# Altium project pcb.PrjPcb
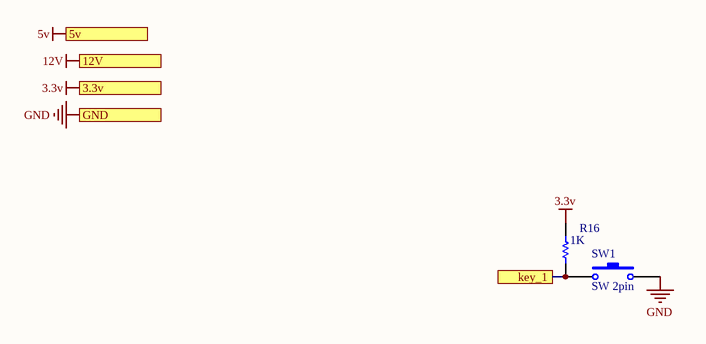
[diagram p0: key.SchDoc]
5 sheets, 153 parts. Net scope: flat (ports and power ports of the same name join across sheets).
Board file: pcb.PcbDoc
Sheets:
  key.SchDoc
  main.SchDoc
  Memory.SchDoc
  power.SchDoc
  comicition.SchDoc

## Sheet key.SchDoc
size A4

### Parts
R16  value 1K  [RES 0805 optional]  (hidden comment: resistor)
SW1  SW 2pin  [SW 2PIN]

### Ports
3.3v, 5v, 12V, GND, key_1

### Nets
3.3v: R16.2 ; port 3.3v
GND: SW1.2 ; port GND
NetR16_1: R16.1 SW1.1 ; port key_1

## Sheet main.SchDoc
size A4
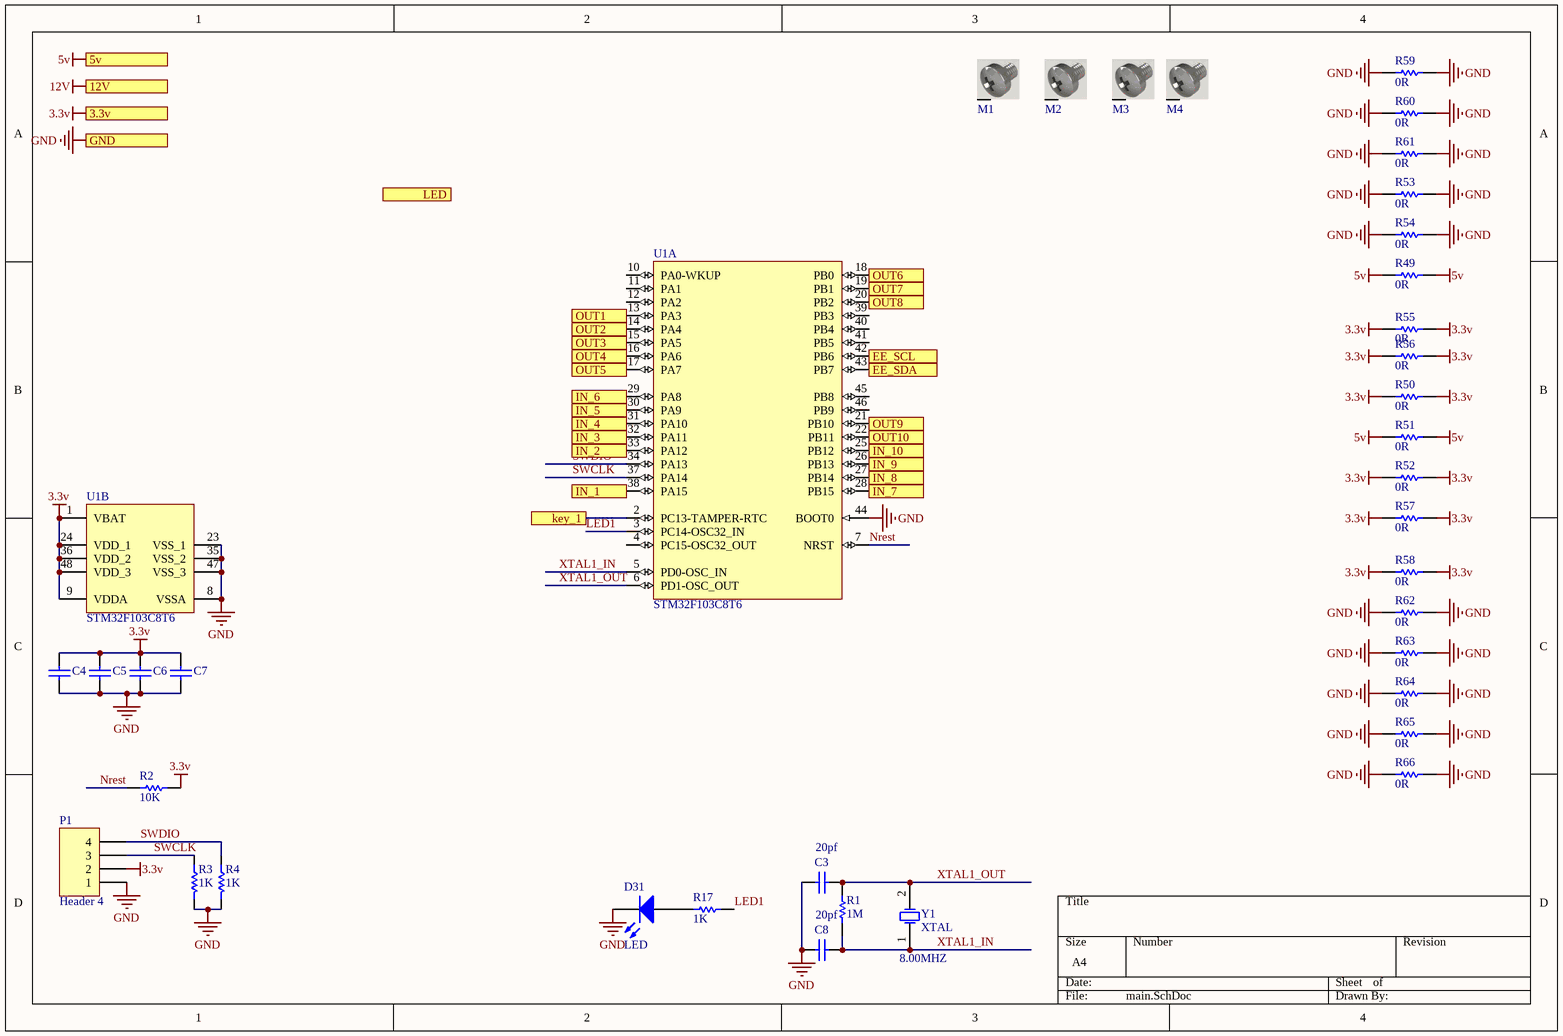
[diagram p1: main.SchDoc]

### Parts
C3  value 20pf  [RES 0805 (2012X06L)]
C4  (no value)  [RES 0805 (2012X06L)]
C5  (no value)  [RES 0805 (2012X06L)]
C6  (no value)  [RES 0805 (2012X06L)]
C7  (no value)  [RES 0805 (2012X06L)]
C8  value 20pf  [RES 0805 (2012X06L)]
D31  LED  [led 5mm]
M1  Screw  [Board Screw]  (value not drawn)
M2  Screw  [Board Screw]  (value not drawn)
M3  Screw  [Board Screw]  (value not drawn)
M4  Screw  [Board Screw]  (value not drawn)
P1  Header 4  [HDR1X4]
R1  value 1M  [RES 0805 (2012X06L)]  (hidden comment: Res1)
R2  valv: 10K  [RES 0805 (2012X06L)]
R3  1K  [RES 0805 (2012X06L)]
R4  1K  [RES 0805 (2012X06L)]
R17  value 1K  [RES 0805 (2012X06L)]  (hidden comment: resistor)
R49  value 0R  [RES 0805 optional]  (hidden comment: resistor)
R50  value 0R  [RES 0805 optional]  (hidden comment: resistor)
R51  value 0R  [RES 0805 optional]  (hidden comment: resistor)
R52  value 0R  [RES 0805 optional]  (hidden comment: resistor)
R53  value 0R  [RES 0805 optional]  (hidden comment: resistor)
R54  value 0R  [RES 0805 optional]  (hidden comment: resistor)
R55  value 0R  [RES 0805 optional]  (hidden comment: resistor)
R56  value 0R  [RES 0805 optional]  (hidden comment: resistor)
R57  value 0R  [RES 0805 optional]  (hidden comment: resistor)
R58  value 0R  [RES 0805 optional]  (hidden comment: resistor)
R59  value 0R  [RES 0805 optional]  (hidden comment: resistor)
R60  value 0R  [RES 0805 optional]  (hidden comment: resistor)
R61  value 0R  [RES 0805 optional]  (hidden comment: resistor)
R62  value 0R  [RES 0805 optional]  (hidden comment: resistor)
R63  value 0R  [RES 0805 optional]  (hidden comment: resistor)
R64  value 0R  [RES 0805 optional]  (hidden comment: resistor)
R65  value 0R  [RES 0805 optional]  (hidden comment: resistor)
R66  value 0R  [RES 0805 optional]  (hidden comment: resistor)
U1  STM32F103C8T6  [STM-LQFP48_N]  (parts A,B of 2)
Y1  XTAL  [Xtal]

### Ports
3.3v, 5v, 12V, EE_SCL, EE_SDA, GND, IN_1 (in), IN_2 (in), IN_3 (in), IN_4 (in), IN_5 (in), IN_6 (in), IN_7 (in), IN_8 (in), IN_9 (in), IN_10 (in), key_1, LED, OUT1 (out), OUT2 (out), OUT3 (out), OUT4 (out), OUT5 (out), OUT6 (out), OUT7 (out), OUT8 (out), OUT9 (out), OUT10 (out)

### Nets
3.3v: C4.2 C5.2 C6.2 C7.2 P1.2 R2.2 R50.1 R50.2 R52.1 R52.2 R55.1 R55.2 R56.1 R56.2 R57.1 R57.2 R58.1 R58.2 U1.1(VBAT) U1.9(VDDA) U1.24(VDD_1) U1.36(VDD_2) U1.48(VDD_3) ; port 3.3v
5v: R49.1 R49.2 R51.1 R51.2 ; port 5v
GND: C3.2 C4.1 C5.1 C6.1 C7.1 C8.2 D31.2(K) P1.1 R3.2 R4.2 R53.1 R53.2 R54.1 R54.2 R59.1 R59.2 R60.1 R60.2 R61.1 R61.2 R62.1 R62.2 R63.1 R63.2 R64.1 R64.2 R65.1 R65.2 R66.1 R66.2 U1.8(VSSA) U1.23(VSS_1) U1.35(VSS_2) U1.44(BOOT0) U1.47(VSS_3) ; port GND
LED1: R17.2 U1.3(PC14-OSC32_IN)
Nrest: R2.1 U1.7(NRST)
SWCLK: P1.3 R3.1 U1.37(PA14)
SWDIO: P1.4 R4.1 U1.34(PA13)
XTAL1_IN: C8.1 R1.1 U1.5(PD0-OSC_IN) Y1.1(OSC1)
XTAL1_OUT: C3.1 R1.2 U1.6(PD1-OSC_OUT) Y1.2(OSC2)
NetD2_1: U1.38(PA15) ; port IN_1
NetD5_1: U1.33(PA12) ; port IN_2
NetD9_1: U1.32(PA11) ; port IN_3
NetD12_1: U1.31(PA10) ; port IN_4
NetD15_1: U1.30(PA9) ; port IN_5
NetD18_1: U1.29(PA8) ; port IN_6
NetD21_1: U1.28(PB15) ; port IN_7
NetD25_1: U1.27(PB14) ; port IN_8
NetD27_1: U1.26(PB13) ; port IN_9
NetD29_1: U1.25(PB12) ; port IN_10
NetD31_1: D31.1(A) R17.1
NetR14_1: U1.42(PB6) ; port EE_SCL
NetR15_1: U1.43(PB7) ; port EE_SDA
NetR16_1: U1.2(PC13-TAMPER-RTC) ; port key_1
NetU1_13: U1.13(PA3) ; port OUT1
NetU1_14: U1.14(PA4) ; port OUT2
NetU1_15: U1.15(PA5) ; port OUT3
NetU1_16: U1.16(PA6) ; port OUT4
NetU1_17: U1.17(PA7) ; port OUT5
NetU1_18: U1.18(PB0) ; port OUT6
NetU1_19: U1.19(PB1) ; port OUT7
NetU1_20: U1.20(PB2) ; port OUT8
NetU1_21: U1.21(PB10) ; port OUT9
NetU1_22: U1.22(PB11) ; port OUT10

Not connected (* = marked no-connect by the designer): M1 S; M2 S; M3 S; M4 S; U1 4(PC15-OSC32_OUT) 10(PA0-WKUP) 11(PA1) 12(PA2) 39(PB3) 40(PB4) 41(PB5) 45(PB8) 46(PB9)

### Notes on the sheet
- (in symbol XTAL) 8.00MHZ

### Library data of the parts
C3-C8 = Cap: Capacitor; Published: 8-Jun-2000; LatestRevisionDate: 17-Jul-2002; LatestRevisionNote: Re-released for DXP Platform.; PackageReference: RAD-0.3; Publisher: Altium Limited
M1-M4 = Pich: Board Screw With Spacer
P1 = Header 4: Header, 4-Pin; LatestRevisionDate: 17-Jul-2002; LatestRevisionNote: Re-released for DXP Platform.; Publisher: Altium Limited
R1 = Res1: Resistor; Published: 8-Jun-2000; LatestRevisionDate: 17-Jul-2002; LatestRevisionNote: Re-released for DXP Platform.; PackageReference: AXIAL-0.3; Publisher: Altium Limited
R2 = resistor
R3 R4 = Resistor: Tolerance: 5%; Power: 1/8 W; Value: 1K
U1 = STM32F103C8T6: ARM Cortex-M3 32-bit MCU, 64 KB Flash, 20 KB Internal RAM, 37 I/Os, 48-pin LQFP, -40 to 85 degC, Tray; A/D Converter: 2x12-bit (10 Channel); FLASH Size (Prog) (kB): 64; I/Os (High Current): 37; Internal RAM Size (kB): 20; Operating Frequency(F) (Processor speed) (MHz): 72; Supply Voltage(Vcc) min (V): 2; DatasheetVersion: Rev. 16; PackageVersion: Rev. 6, 06/2013; PackageReference: LQFP48; PackageDescription: 48-Pin Low Profile Quad Flat Package, 7 x 7 mm Body, 0.5 mm Pitch; Supplier 1: Digi-Key; Supplier Part Number 1: 497-6063-ND; Supplier 2: Farnell; Supplier Part Number 2: 1447637; Supplier 3: Newark; Supplier Part Number 3: 59M2182; Supplier 4: Newark; Supplier Part Number 4: 57P1222; Supplier 5: Mouser; Supplier Part Number 5: 511-STM32F103C8T6; Core: ARM Cortex-M3; Packing: Tray; Mounting Technology: Surface Mount; PartNumber: STM32F103C8T6; ComponentLink1Description: Manufacturer URL; ComponentLink1URL: http://www.st.com/web/en/home.html; ComponentLink2Description: Datasheet; ComponentLink2URL: http://www.st.com/st-web-ui/static/active/en/resource/technical/document/datasheet/CD00161566.pdf; ComponentLink3Description: Package Specification; ComponentLink3URL: http://www.st.com/st-web-ui/static/active/en/resource/technical/document/datasheet/DM00058181.pdf

## Sheet Memory.SchDoc
size A4
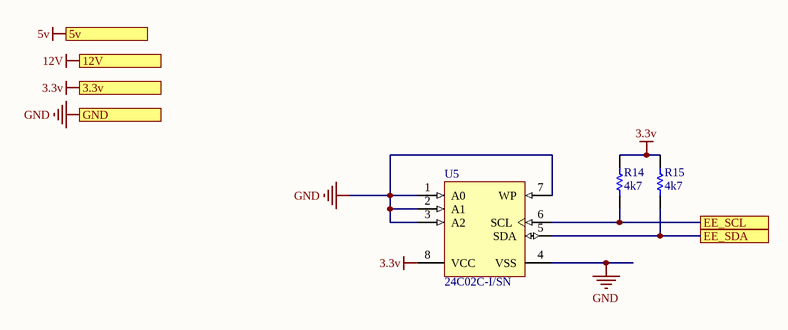
[diagram p2: Memory.SchDoc]

### Parts
R14  value 4k7  [RES 0805 (2012X06L)]  (hidden comment: Res1)
R15  value 4k7  [RES 0805 optional]  (hidden comment: Res1)
U5  24C02C-I/SN  [SOIC-SN8_L]

### Ports
3.3v, 5v, 12V, EE_SCL, EE_SDA, GND

### Nets
3.3v: R14.2 R15.2 U5.8(VCC) ; port 3.3v
GND: U5.1(A0) U5.2(A1) U5.3(A2) U5.4(VSS) U5.7(WP) ; port GND
NetR14_1: R14.1 U5.6(SCL) ; port EE_SCL
NetR15_1: R15.1 U5.5(SDA) ; port EE_SDA

### Library data of the parts
R14 R15 = Res1: Resistor; Published: 8-Jun-2000; LatestRevisionDate: 17-Jul-2002; LatestRevisionNote: Re-released for DXP Platform.; PackageReference: AXIAL-0.3; Publisher: Altium Limited
U5 = 24C02C-I/SN: 2Kbit, 400kHz, 5V, I2C Serial EEPROM, 8-Pin SOIC 150mil, Industrial Temperature; Published: 29-Jan-2009; DatasheetVersion: revJ, Aug-2008; PackageVersion: revBB, Aug-2009; PackageReference: SOIC-SN8; Publisher: Altium Limited; PackageDescription: 8-Lead Plastic Small Outline (SN) - Narrow, 3.90mm Body [SOIC]; Supplier 1: Digi-Key; Supplier Part Number 1: 24C02C-I/SN-ND; Supplier 2: Farnell; Supplier Part Number 2: 1084339; Code_JEDEC: MS-012; Code_IPC: SOIC127P600-8; ComponentLink1Description: Datasheet; ComponentLink1URL: http://ww1.microchip.com/downloads/en/DeviceDoc/21202J.pdf; ComponentLink2Description: Packaging Specification; ComponentLink2URL: http://www.microchip.com/stellent/groups/techpub_sg/documents/packagingspec/en012702.pdf; ComponentLink3Description: Microchip.com Home; ComponentLink3URL: http://www.microchip.com/

## Sheet power.SchDoc
size A4
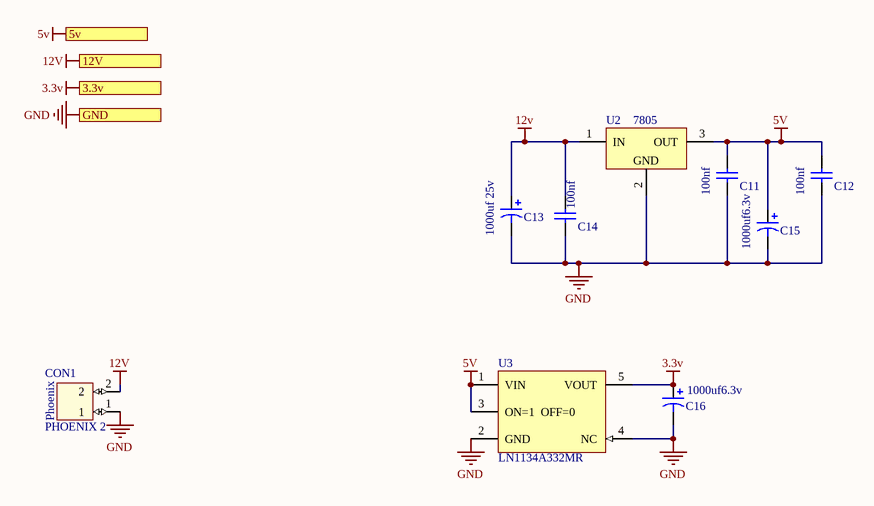
[diagram p3: power.SchDoc]

### Parts
C11  Valu: 100nf  [RES 1206 (3216X08L)]  (hidden comment: Non Polarity)
C12  Valu: 100nf  [RES 0805 (2012X06L)]  (hidden comment: Non Polarity)
C13  Valu: 1000uf 25v  [RB5-10.5]  (hidden comment: Polarity)
C14  Valu: 100nf  [RES 0805 (2012X06L)]  (hidden comment: Non Polarity)
C15  Valu: 1000uf6.3v  [RB5-10]  (hidden comment: Polarity)
C16  Valu: 1000uf6.3v  [RB5-10]  (hidden comment: Polarity)
CON1  PHOENIX 2  [phonix 2]
U2  7805  [reg SMD1A small]
U3  LN1134A332MR  [SOT23-5_N]

### Ports
3.3v, 5v, 12V, GND

### Nets
3.3v: C16.1 U3.5(VOUT) ; port 3.3v
5v: C11.2 C12.2 C15.1 U2.3(OUT) U3.1(VIN) U3.3(ON=1__OFF=0) ; port 5v
12V: C13.1 C14.2 CON1.2 U2.1(IN) ; port 12V
GND: C11.1 C12.1 C13.2 C14.1 C15.2 C16.2 CON1.1 U2.2(GND) U3.2(GND) U3.4(NC) ; port GND

### Notes on the sheet
- (in symbol PHOENIX 2) Phoenix

### Library data of the parts
C11 C12 C14 = Cap
C13 C15 C16 = Cap_Polarity
CON1 = PHOENIX 2: pin to pad: 1>2 2>1
U2 = 78XX
U3 = LN1134A332MR: Voltage - Input (Max): 7v; Voltage - Output (Fixed): 3.3v; Output Current: 300mA; PackageDescription: 5-Pin Small Outline Transistor Package, Body 2.9 x 1.6 mm, Pitch 0.95 mm

## Sheet comicition.SchDoc
size A4
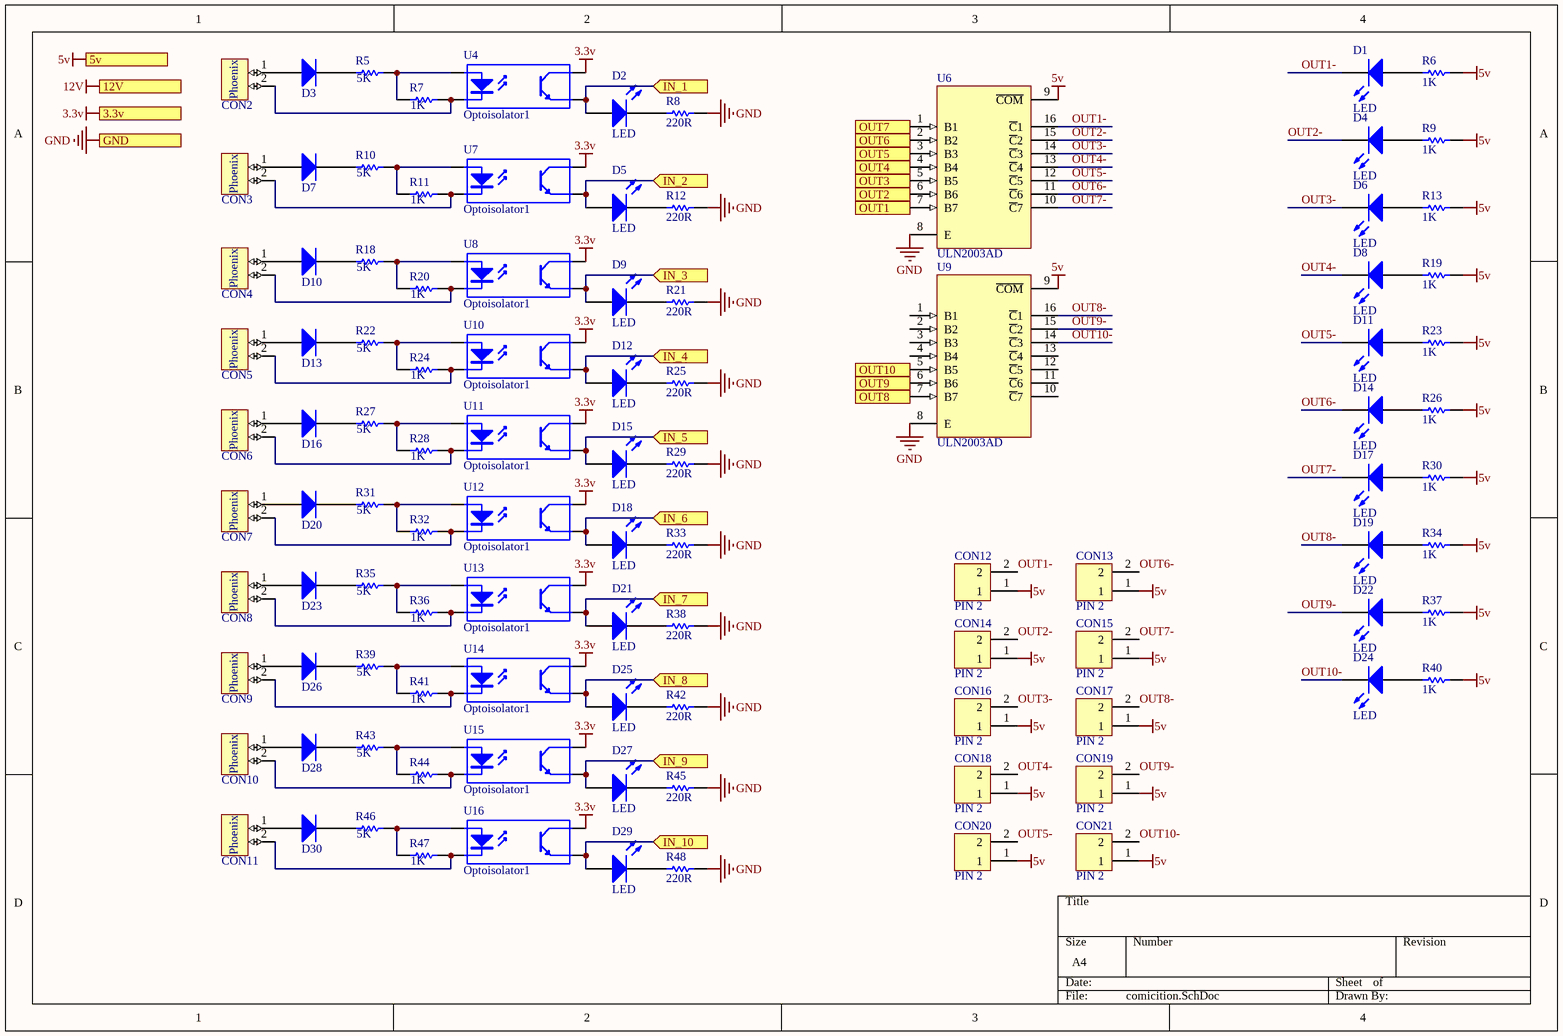
[diagram p4: comicition.SchDoc]

### Parts
CON2  PHOENIX 2  [phonix 2]  (value not drawn)
CON3  PHOENIX 2  [phonix 2]  (value not drawn)
CON4  PHOENIX 2  [phonix 2]  (value not drawn)
CON5  PHOENIX 2  [phonix 2]  (value not drawn)
CON6  PHOENIX 2  [phonix 2]  (value not drawn)
CON7  PHOENIX 2  [phonix 2]  (value not drawn)
CON8  PHOENIX 2  [phonix 2]  (value not drawn)
CON9  PHOENIX 2  [phonix 2]  (value not drawn)
CON10  PHOENIX 2  [phonix 2]  (value not drawn)
CON11  PHOENIX 2  [phonix 2]  (value not drawn)
CON12  PIN 2  [PIN 2]
CON13  PIN 2  [PIN 2]
CON14  PIN 2  [PIN 2]
CON15  PIN 2  [PIN 2]
CON16  PIN 2  [PIN 2]
CON17  PIN 2  [PIN 2]
CON18  PIN 2  [PIN 2]
CON19  PIN 2  [PIN 2]
CON20  PIN 2  [PIN 2]
CON21  PIN 2  [PIN 2]
D1  LED  [led 5mm]
D2  LED  [led 5mm]
D3  1N4007  [RES 1206 (3216X08L)]  (value not drawn)
D4  LED  [led 5mm]
D5  LED  [led 5mm]
D6  LED  [led 5mm]
D7  1N4007  [RES 1206 (3216X08L)]  (value not drawn)
D8  LED  [led 5mm]
D9  LED  [led 5mm]
D10  1N4007  [RES 1206 (3216X08L)]  (value not drawn)
D11  LED  [led 5mm]
D12  LED  [led 5mm]
D13  1N4007  [RES 1206 (3216X08L)]  (value not drawn)
D14  LED  [led 5mm]
D15  LED  [led 5mm]
D16  1N4007  [RES 1206 (3216X08L)]  (value not drawn)
D17  LED  [led 5mm]
D18  LED  [led 5mm]
D19  LED  [led 5mm]
D20  1N4007  [RES 1206 (3216X08L)]  (value not drawn)
D21  LED  [led 5mm]
D22  LED  [led 5mm]
D23  1N4007  [RES 1206 (3216X08L)]  (value not drawn)
D24  LED  [led 5mm]
D25  LED  [led 5mm]
D26  1N4007  [RES 1206 (3216X08L)]  (value not drawn)
D27  LED  [led 5mm]
D28  1N4007  [RES 1206 (3216X08L)]  (value not drawn)
D29  LED  [led 5mm]
D30  1N4007  [RES 1206 (3216X08L)]  (value not drawn)
R5  value 5K  [RES 0805 (2012X06L)]  (hidden comment: resistor)
R6  value 1K  [RES 0805 (2012X06L)]  (hidden comment: resistor)
R7  value 1K  [RES 0805 (2012X06L)]  (hidden comment: resistor)
R8  value 220R  [RES 0805 optional]  (hidden comment: resistor)
R9  value 1K  [RES 0805 (2012X06L)]  (hidden comment: resistor)
R10  value 5K  [RES 0805 (2012X06L)]  (hidden comment: resistor)
R11  value 1K  [RES 0805 (2012X06L)]  (hidden comment: resistor)
R12  value 220R  [RES 0805 optional]  (hidden comment: resistor)
R13  value 1K  [RES 0805 (2012X06L)]  (hidden comment: resistor)
R18  value 5K  [RES 0805 (2012X06L)]  (hidden comment: resistor)
R19  value 1K  [RES 0805 (2012X06L)]  (hidden comment: resistor)
R20  value 1K  [RES 0805 (2012X06L)]  (hidden comment: resistor)
R21  value 220R  [RES 0805 optional]  (hidden comment: resistor)
R22  value 5K  [RES 0805 (2012X06L)]  (hidden comment: resistor)
R23  value 1K  [RES 0805 (2012X06L)]  (hidden comment: resistor)
R24  value 1K  [RES 0805 (2012X06L)]  (hidden comment: resistor)
R25  value 220R  [RES 0805 optional]  (hidden comment: resistor)
R26  value 1K  [RES 0805 (2012X06L)]  (hidden comment: resistor)
R27  value 5K  [RES 0805 (2012X06L)]  (hidden comment: resistor)
R28  value 1K  [RES 0805 (2012X06L)]  (hidden comment: resistor)
R29  value 220R  [RES 0805 optional]  (hidden comment: resistor)
R30  value 1K  [RES 0805 (2012X06L)]  (hidden comment: resistor)
R31  value 5K  [RES 0805 (2012X06L)]  (hidden comment: resistor)
R32  value 1K  [RES 0805 (2012X06L)]  (hidden comment: resistor)
R33  value 220R  [RES 0805 optional]  (hidden comment: resistor)
R34  value 1K  [RES 0805 (2012X06L)]  (hidden comment: resistor)
R35  value 5K  [RES 0805 (2012X06L)]  (hidden comment: resistor)
R36  value 1K  [RES 0805 (2012X06L)]  (hidden comment: resistor)
R37  value 1K  [RES 0805 (2012X06L)]  (hidden comment: resistor)
R38  value 220R  [RES 0805 optional]  (hidden comment: resistor)
R39  value 5K  [RES 0805 (2012X06L)]  (hidden comment: resistor)
R40  value 1K  [RES 0805 (2012X06L)]  (hidden comment: resistor)
R41  value 1K  [RES 0805 (2012X06L)]  (hidden comment: resistor)
R42  value 220R  [RES 0805 optional]  (hidden comment: resistor)
R43  value 5K  [RES 0805 (2012X06L)]  (hidden comment: resistor)
R44  value 1K  [RES 0805 (2012X06L)]  (hidden comment: resistor)
R45  value 220R  [RES 0805 optional]  (hidden comment: resistor)
R46  value 5K  [RES 0805 (2012X06L)]  (hidden comment: resistor)
R47  value 1K  [RES 0805 (2012X06L)]  (hidden comment: resistor)
R48  value 220R  [RES 0805 optional]  (hidden comment: resistor)
U4  Optoisolator1  [DIP-4]
U6  ULN2003AD  [D016_N]
U7  Optoisolator1  [DIP-4]
U8  Optoisolator1  [DIP-4]
U9  ULN2003AD  [D016_N]
U10  Optoisolator1  [DIP-4]
U11  Optoisolator1  [DIP-4]
U12  Optoisolator1  [DIP-4]
U13  Optoisolator1  [DIP-4]
U14  Optoisolator1  [DIP-4]
U15  Optoisolator1  [DIP-4]
U16  Optoisolator1  [DIP-4]

### Ports
3.3v, 5v, 12V, GND, IN_1 (in), IN_2 (in), IN_3 (in), IN_4 (in), IN_5 (in), IN_6 (in), IN_7 (in), IN_8 (in), IN_9 (in), IN_10 (in), OUT1 (out), OUT2 (out), OUT3 (out), OUT4 (out), OUT5 (out), OUT6 (out), OUT7 (out), OUT8 (out), OUT9 (out), OUT10 (out)

### Nets
3.3v: U4.4(C) U7.4(C) U8.4(C) U10.4(C) U11.4(C) U12.4(C) U13.4(C) U14.4(C) U15.4(C) U16.4(C) ; port 3.3v
5v: CON12.1 CON13.1 CON14.1 CON15.1 CON16.1 CON17.1 CON18.1 CON19.1 CON20.1 CON21.1 R6.2 R9.2 R13.2 R19.2 R23.2 R26.2 R30.2 R34.2 R37.2 R40.2 U6.9(~{COM}) U9.9(~{COM}) ; port 5v
GND: R8.1 R12.1 R21.1 R25.1 R29.1 R33.1 R38.1 R42.1 R45.1 R48.1 U6.8(E) U9.8(E) ; port GND
OUT1-: CON12.2 D1.2(K) U6.16(~{C}1)
OUT2-: CON14.2 D4.2(K) U6.15(~{C}2)
OUT3-: CON16.2 D6.2(K) U6.14(~{C}3)
OUT4-: CON18.2 D8.2(K) U6.13(~{C}4)
OUT5-: CON20.2 D11.2(K) U6.12(~{C}5)
OUT6-: CON13.2 D14.2(K) U6.11(~{C}6)
OUT7-: CON15.2 D17.2(K) U6.10(~{C}7)
OUT8-: CON17.2 D19.2(K) U9.16(~{C}1)
OUT9-: CON19.2 D22.2(K) U9.15(~{C}2)
OUT10-: CON21.2 D24.2(K) U9.14(~{C}3)
NetCON2_1: CON2.1 D3.1(A)
NetCON2_2: CON2.2 R7.2 U4.2(K)
NetCON3_1: CON3.1 D7.1(A)
NetCON3_2: CON3.2 R11.2 U7.2(K)
NetCON4_1: CON4.1 D10.1(A)
NetCON4_2: CON4.2 R20.2 U8.2(K)
NetCON5_1: CON5.1 D13.1(A)
NetCON5_2: CON5.2 R24.2 U10.2(K)
NetCON6_1: CON6.1 D16.1(A)
NetCON6_2: CON6.2 R28.2 U11.2(K)
NetCON7_1: CON7.1 D20.1(A)
NetCON7_2: CON7.2 R32.2 U12.2(K)
NetCON8_1: CON8.1 D23.1(A)
NetCON8_2: CON8.2 R36.2 U13.2(K)
NetCON9_1: CON9.1 D26.1(A)
NetCON9_2: CON9.2 R41.2 U14.2(K)
NetCON10_1: CON10.1 D28.1(A)
NetCON10_2: CON10.2 R44.2 U15.2(K)
NetCON11_1: CON11.1 D30.1(A)
NetCON11_2: CON11.2 R47.2 U16.2(K)
NetD1_1: D1.1(A) R6.1
NetD2_1: D2.1(A) U4.3(E) ; port IN_1
NetD2_2: D2.2(K) R8.2
NetD3_2: D3.2(K) R5.1
NetD4_1: D4.1(A) R9.1
NetD5_1: D5.1(A) U7.3(E) ; port IN_2
NetD5_2: D5.2(K) R12.2
NetD6_1: D6.1(A) R13.1
NetD7_2: D7.2(K) R10.1
NetD8_1: D8.1(A) R19.1
NetD9_1: D9.1(A) U8.3(E) ; port IN_3
NetD9_2: D9.2(K) R21.2
NetD10_2: D10.2(K) R18.1
NetD11_1: D11.1(A) R23.1
NetD12_1: D12.1(A) U10.3(E) ; port IN_4
NetD12_2: D12.2(K) R25.2
NetD13_2: D13.2(K) R22.1
NetD14_1: D14.1(A) R26.1
NetD15_1: D15.1(A) U11.3(E) ; port IN_5
NetD15_2: D15.2(K) R29.2
NetD16_2: D16.2(K) R27.1
NetD17_1: D17.1(A) R30.1
NetD18_1: D18.1(A) U12.3(E) ; port IN_6
NetD18_2: D18.2(K) R33.2
NetD19_1: D19.1(A) R34.1
NetD20_2: D20.2(K) R31.1
NetD21_1: D21.1(A) U13.3(E) ; port IN_7
NetD21_2: D21.2(K) R38.2
NetD22_1: D22.1(A) R37.1
NetD23_2: D23.2(K) R35.1
NetD24_1: D24.1(A) R40.1
NetD25_1: D25.1(A) U14.3(E) ; port IN_8
NetD25_2: D25.2(K) R42.2
NetD26_2: D26.2(K) R39.1
NetD27_1: D27.1(A) U15.3(E) ; port IN_9
NetD27_2: D27.2(K) R45.2
NetD28_2: D28.2(K) R43.1
NetD29_1: D29.1(A) U16.3(E) ; port IN_10
NetD29_2: D29.2(K) R48.2
NetD30_2: D30.2(K) R46.1
NetR5_2: R5.2 R7.1 U4.1(A)
NetR10_2: R10.2 R11.1 U7.1(A)
NetR18_2: R18.2 R20.1 U8.1(A)
NetR22_2: R22.2 R24.1 U10.1(A)
NetR27_2: R27.2 R28.1 U11.1(A)
NetR31_2: R31.2 R32.1 U12.1(A)
NetR35_2: R35.2 R36.1 U13.1(A)
NetR39_2: R39.2 R41.1 U14.1(A)
NetR43_2: R43.2 R44.1 U15.1(A)
NetR46_2: R46.2 R47.1 U16.1(A)
NetU1_13: U6.7(B7) ; port OUT1
NetU1_14: U6.6(B6) ; port OUT2
NetU1_15: U6.5(B5) ; port OUT3
NetU1_16: U6.4(B4) ; port OUT4
NetU1_17: U6.3(B3) ; port OUT5
NetU1_18: U6.2(B2) ; port OUT6
NetU1_19: U6.1(B1) ; port OUT7
NetU1_20: U9.7(B7) ; port OUT8
NetU1_21: U9.6(B6) ; port OUT9
NetU1_22: U9.5(B5) ; port OUT10

Not connected (* = marked no-connect by the designer): U9 1(B1) 2(B2) 3(B3) 4(B4) 10(~{C}7) 11(~{C}6) 12(~{C}5) 13(~{C}4)

### Notes on the sheet
- (in symbol PHOENIX 2) Phoenix

### Library data of the parts
U4 U7 U8 U10-U16 = Optoisolator1: 4-Pin Phototransistor Optocoupler; Published: 24-Mar-1999; LatestRevisionDate: 04-Mar-2005; LatestRevisionNote: Sch pins 3 & 4 Swapped.; DatasheetVersion: Nov-2003; PackageReference: DIP-4; Publisher: Altium Limited
U6 U9 = ULN2003AD: Darlington Transistor Array; Published: 15-May-2002; LatestRevisionDate: 13-Apr-2006; LatestRevisionNote: IPC-7351 Footprint Added.; DatasheetVersion: Sep-1986; PackageVersion: Jan-1998; PackageReference: D016; Publisher: Altium Limited; PackageDescription: 16-Pin Small Outline Integrated Circuit 1.27 mm Pitch; Code_IPC: SOIC127P600-16; ComponentLink1Description: Manufacturer Link; ComponentLink1URL: http://www.ti.com/; ComponentLink2Description: Datasheet; ComponentLink2URL: http://www-s.ti.com/sc/ds/uln2002a.pdf

## Nets that join several sheets
3.3v: key (R16.2), main (23 pins), Memory (R14.2 R15.2 U5.8), power (C16.1 U3.5), comicition (10 pins)
5v: main (R49.1 R49.2 R51.1 R51.2), power (6 pins), comicition (22 pins)
GND: key (SW1.2), main (35 pins), Memory (5 pins), power (10 pins), comicition (12 pins)
NetD2_1: main (U1.38), comicition (D2.1 U4.3)
NetD5_1: main (U1.33), comicition (D5.1 U7.3)
NetD9_1: main (U1.32), comicition (D9.1 U8.3)
NetD12_1: main (U1.31), comicition (D12.1 U10.3)
NetD15_1: main (U1.30), comicition (D15.1 U11.3)
NetD18_1: main (U1.29), comicition (D18.1 U12.3)
NetD21_1: main (U1.28), comicition (D21.1 U13.3)
NetD25_1: main (U1.27), comicition (D25.1 U14.3)
NetD27_1: main (U1.26), comicition (D27.1 U15.3)
NetD29_1: main (U1.25), comicition (D29.1 U16.3)
NetR14_1: main (U1.42), Memory (R14.1 U5.6)
NetR15_1: main (U1.43), Memory (R15.1 U5.5)
NetR16_1: key (R16.1 SW1.1), main (U1.2)
NetU1_13: main (U1.13), comicition (U6.7)
NetU1_14: main (U1.14), comicition (U6.6)
NetU1_15: main (U1.15), comicition (U6.5)
NetU1_16: main (U1.16), comicition (U6.4)
NetU1_17: main (U1.17), comicition (U6.3)
NetU1_18: main (U1.18), comicition (U6.2)
NetU1_19: main (U1.19), comicition (U6.1)
NetU1_20: main (U1.20), comicition (U9.7)
NetU1_21: main (U1.21), comicition (U9.6)
NetU1_22: main (U1.22), comicition (U9.5)